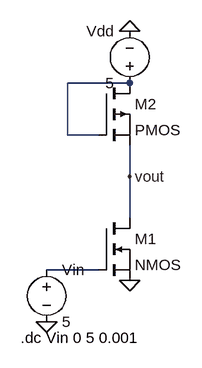
[diagram p0: schematic Draft3.asc]
Draft3.asc, the LTspice schematic file:
Version 4.1
SHEET 1 880 680
WIRE 240 -32 144 -32
WIRE 144 48 144 -32
WIRE 192 48 144 48
WIRE 240 112 240 64
WIRE 240 176 240 112
WIRE 192 256 112 256
FLAG 240 272 0
FLAG 240 -112 0
FLAG 112 336 0
FLAG 240 112 vout
SYMBOL nmos 192 176 R0
SYMATTR InstName M1
SYMBOL pmos 192 -32 R0
SYMATTR InstName M2
SYMBOL voltage 112 240 R0
SYMATTR InstName Vin
SYMATTR Value 5
SYMBOL voltage 240 -16 R180
WINDOW 0 24 96 Left 2
WINDOW 3 24 16 Left 2
SYMATTR InstName Vdd
SYMATTR Value 5
TEXT 72 360 Left 2 !.dc Vin 0 5 0.001

The netlist it stands for:
* Draft3.asc
M1 vout N002 0 0 NMOS
M2 N001 N001 vout vout PMOS
Vin N002 0 5
Vdd N001 0 5
.model NMOS NMOS
.model PMOS PMOS
.lib standard.mos
.dc Vin 0 5 0.001
.backanno
.end